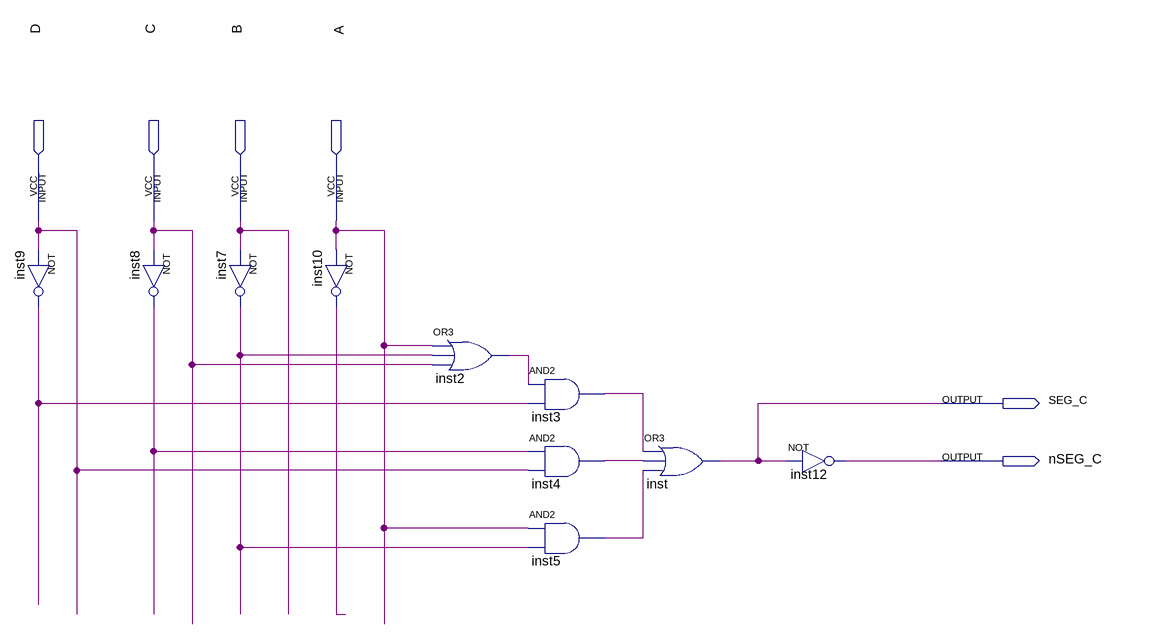
[diagram p0: schematic sheet]
// Quartus schematic SEG_C.bdf as structural Verilog: 10 symbols, 6 pins
module SEG_C (
  input  D,
  input  C,
  input  B,
  input  A,
  output SEG_C,
  output nSEG_C
);

  wire inst2_out, inst3_out, inst4_out, inst5_out, inst7_out, inst8_out, inst9_out, inst10_out;

  not inst9 (inst9_out, D);
  not inst8 (inst8_out, C);
  not inst7 (inst7_out, B);
  not inst10 (inst10_out, A);
  or inst2 (inst2_out, A, inst7_out, C);
  and inst3 (inst3_out, inst2_out, inst9_out);
  and inst4 (inst4_out, inst8_out, D);
  and inst5 (inst5_out, A, inst7_out);
  or inst (SEG_C, inst3_out, inst4_out, inst5_out);
  not inst12 (nSEG_C, SEG_C);
endmodule
